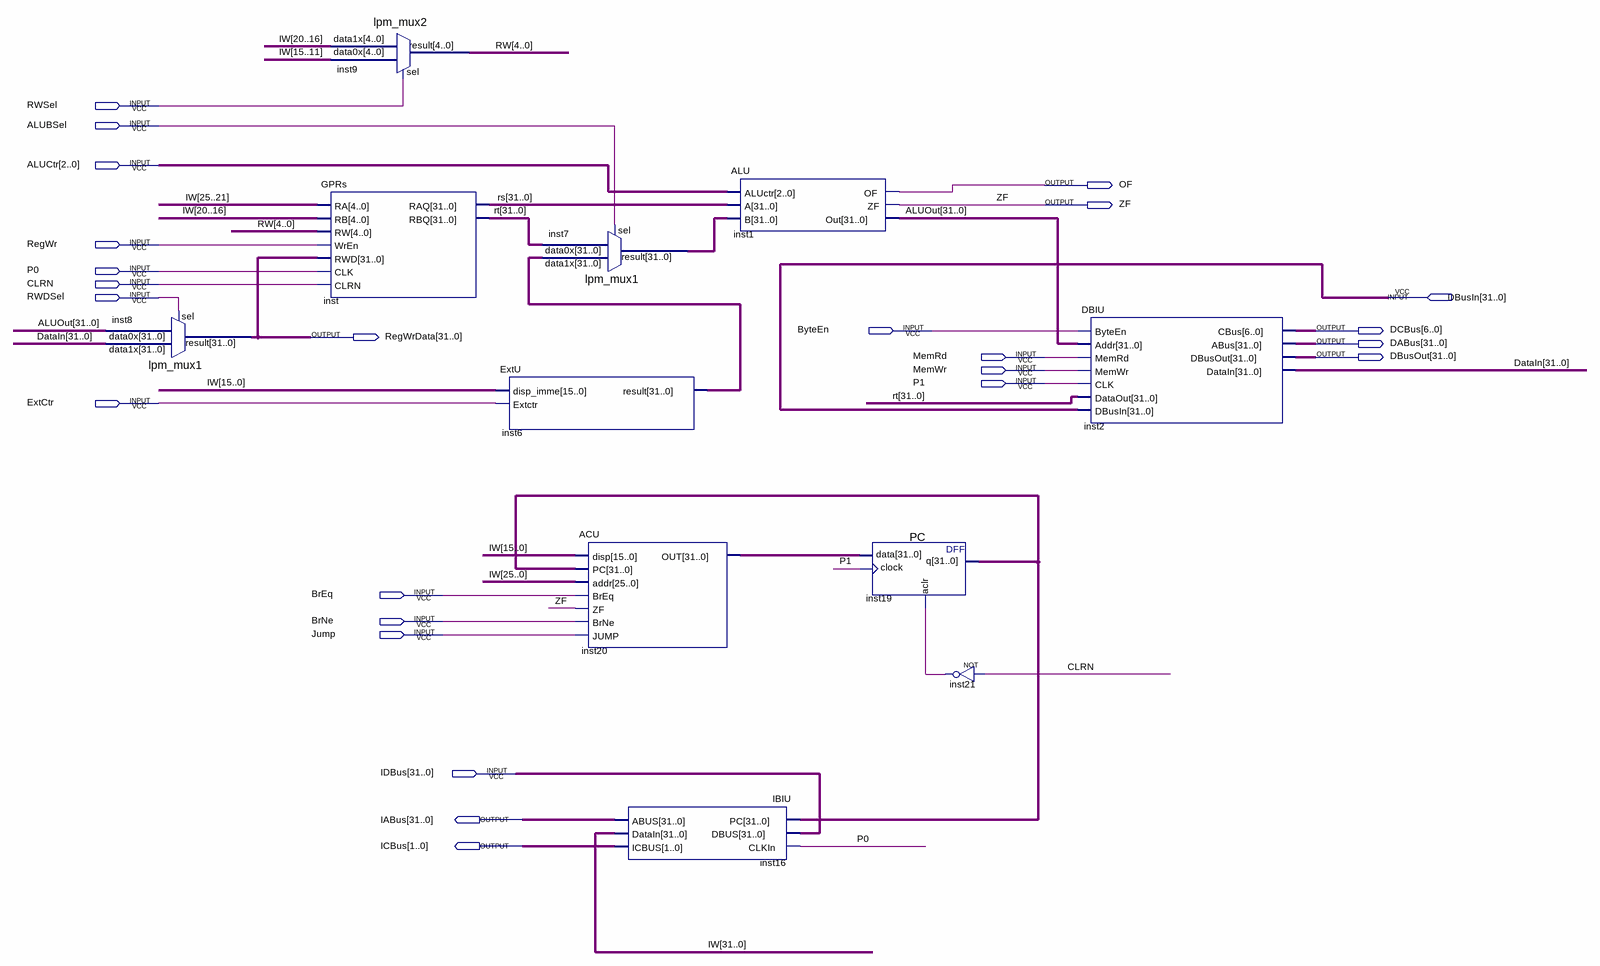
[diagram p0: schematic sheet]
// Quartus schematic DataPath.bdf as structural Verilog: 11 symbols, 25 pins
module DataPath (
  input  RWSel,
  input  ALUBSel,
  input  [2:0] ALUCtr,
  input  RegWr,
  input  P0,
  input  CLRN,
  input  RWDSel,
  input  [31:0] DBusIn,
  input  ByteEn,
  input  MemRd,
  input  MemWr,
  input  P1,
  input  ExtCtr,
  input  BrEq,
  input  BrNe,
  input  Jump,
  input  [31:0] IDBus,
  output OF,
  output ZF,
  output [6:0] DCBus,
  output [31:0] RegWrData,
  output [31:0] DABus,
  output [31:0] DBusOut,
  output [31:0] IABus,
  output [1:0] ICBus
);

  wire inst21_out;
  wire [4:0] RW;
  wire [31:0] ALUOut, DataIn, inst6_result, inst7_result, inst19_q, inst20_out, IW, rs, rt;

  lpm_mux1 inst8 (.data1x(DataIn), .data0x(ALUOut), .sel(RWDSel), .result(RegWrData));
  lpm_mux2 inst9 (.data1x(IW[20:16]), .data0x(IW[15:11]), .sel(RWSel), .result(RW));
  GPRs inst (
    .RA(IW[25:21]), .RB(IW[20:16]), .RW(RW), .WrEn(RegWr), .RWD(RegWrData), .CLK(P0), .CLRN(CLRN), .RAQ(rs),
    .RBQ(rt));
  ExtU inst6 (.disp_imme(IW[15:0]), .Extctr(ExtCtr), .result(inst6_result));
  lpm_mux1 inst7 (.data1x(inst6_result), .data0x(rt), .sel(ALUBSel), .result(inst7_result));
  ACU inst20 (
    .disp(IW[15:0]), .PC(inst19_q), .addr(IW[25:0]), .BrEq(BrEq), .ZF(ZF), .BrNe(BrNe), .JUMP(Jump),
    .OUT(inst20_out));
  IBIU inst16 (.PC(inst19_q), .DBUS(IDBus), .CLKIn(P0), .ABUS(IABus), .DataIn(IW), .ICBUS(ICBus));
  ALU inst1 (.ALUctr(ALUCtr), .A(rs), .B(inst7_result), .OF(OF), .ZF(ZF), .Out(ALUOut));
  PC inst19 (.data(inst20_out), .clock(P1), .aclr(inst21_out), .q(inst19_q));
  not inst21 (inst21_out, CLRN);
  DBIU inst2 (
    .ByteEn(ByteEn), .Addr(ALUOut), .MemRd(MemRd), .MemWr(MemWr), .CLK(P1), .DataOut(rt), .DBusIn(DBusIn),
    .CBus(DCBus), .ABus(DABus), .DBusOut(DBusOut), .DataIn(DataIn));
endmodule
